# Altium schematic sheet MCU.SchDoc
size Letter
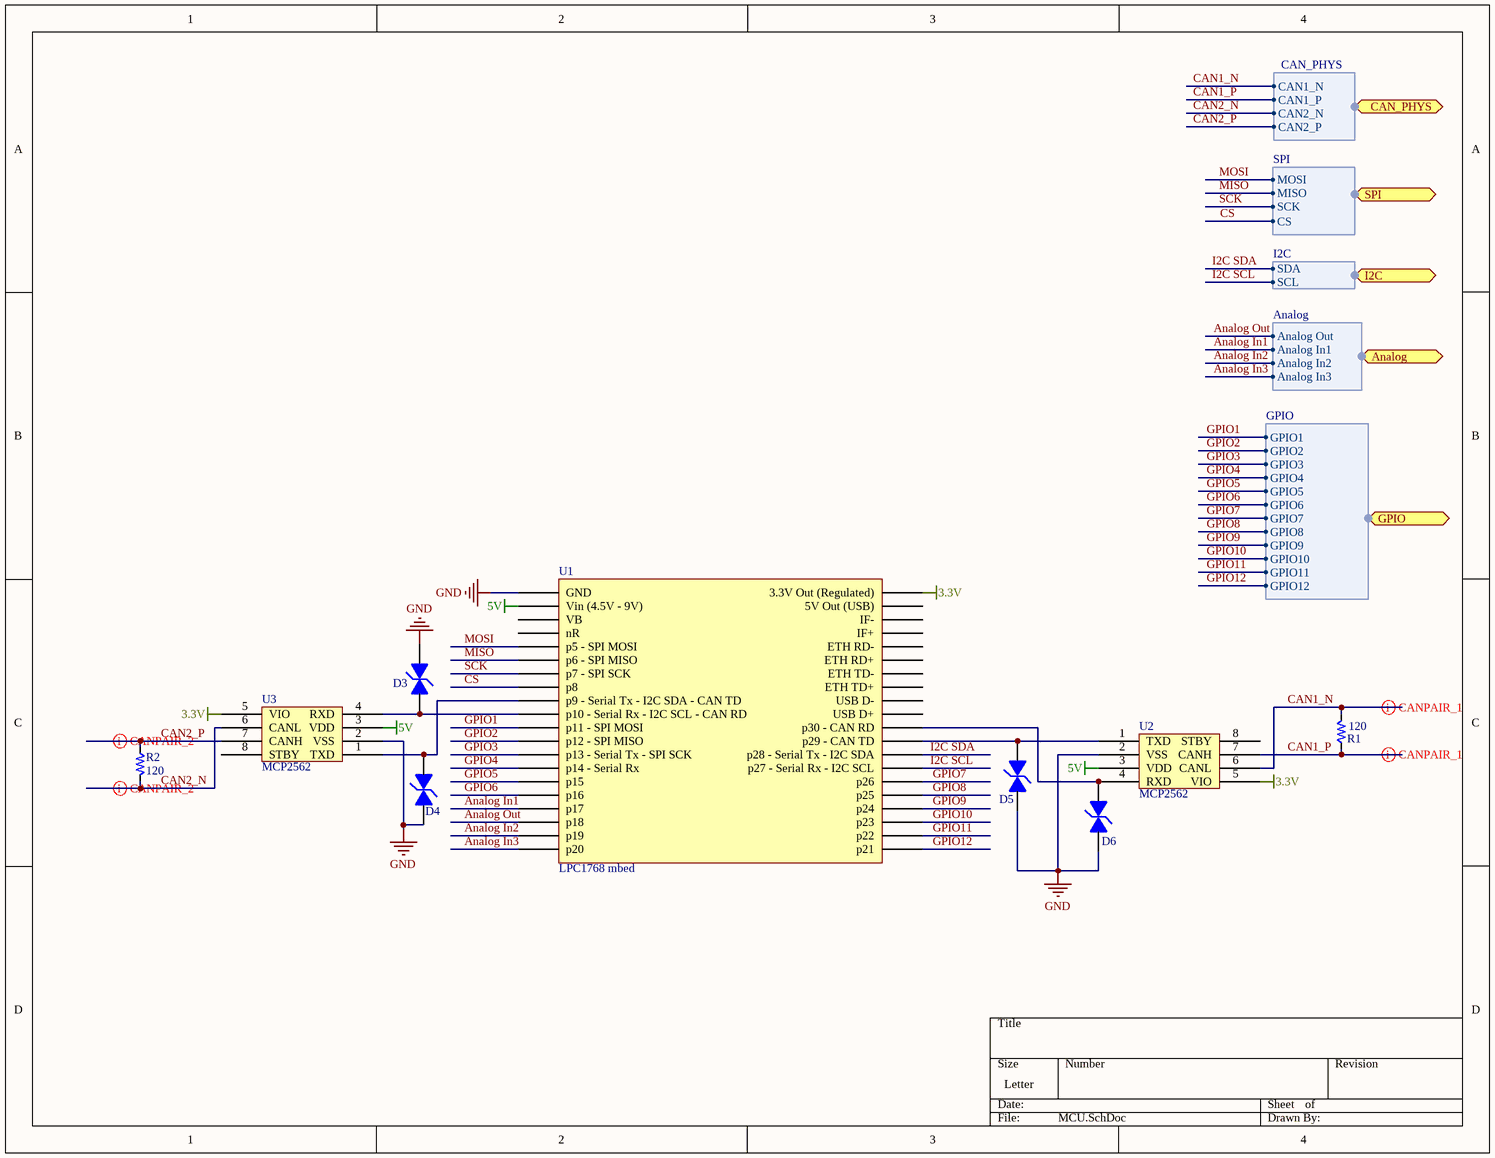
[diagram p0: MCU.SchDoc]

## Parts
D3  TVS Diode  [TVS Diode]  (value not drawn)
D4  TVS Diode  [TVS Diode]  (value not drawn)
D5  TVS Diode  [TVS Diode]  (value not drawn)
D6  TVS Diode  [TVS Diode]  (value not drawn)
R1  120  [PCB_GENERIC_SMD_0603]
R2  120  [PCB_GENERIC_SMD_0603]
U1  LPC1768 mbed  [LPC 1768 mbed Layout]
U2  MCP2562  [MCP2562]
U3  MCP2562  [MCP2562]

## Ports
Analog (harness Analog), CAN_PHYS (harness CAN_PHYS), GPIO (harness GPIO), I2C (harness I2C), SPI (harness SPI)

## Harnesses
CAN_PHYS: CAN1_N, CAN1_P, CAN2_N, CAN2_P
SPI: MOSI, MISO, SCK, CS
I2C: SDA, SCL
GPIO: GPIO1, GPIO2, GPIO3, GPIO4, GPIO5, GPIO6, GPIO7, GPIO8, GPIO9, GPIO10, GPIO11, GPIO12
Analog: Analog Out, Analog In1, Analog In2, Analog In3

## Nets
3.3V: U1.40(3.3V_Out_(Regulated)) U2.5(VIO) U3.5(VIO)
5V: U1.2(Vin_(4.5V_-_9V)) U2.3(VDD) U3.3(VDD)
GND: D3.2 D4.2 D5.1 D6.1 U1.1(GND) U2.2(VSS) U3.2(VSS)
Analog In1: U1.17(p17) ; port Analog.Analog In1
Analog In2: U1.19(p19) ; port Analog.Analog In2
Analog In3: U1.20(p20) ; port Analog.Analog In3
Analog Out: U1.18(p18) ; port Analog.Analog Out
CAN1_N: R1.2 U2.6(CANL) ; port CAN_PHYS.CAN1_N
CAN1_P: R1.1 U2.7(CANH) ; port CAN_PHYS.CAN1_P
CAN2_N: R2.2 U3.6(CANL) ; port CAN_PHYS.CAN2_N
CAN2_P: R2.1 U3.7(CANH) ; port CAN_PHYS.CAN2_P
CS: U1.8(p8) ; port SPI.CS
GPIO1: U1.11(p11_-_SPI_MOSI) ; port GPIO.GPIO1
GPIO2: U1.12(p12_-_SPI_MISO) ; port GPIO.GPIO2
GPIO3: U1.13(p13_-_Serial_Tx_-_SPI_SCK) ; port GPIO.GPIO3
GPIO4: U1.14(p14_-_Serial_Rx) ; port GPIO.GPIO4
GPIO5: U1.15(p15) ; port GPIO.GPIO5
GPIO6: U1.16(p16) ; port GPIO.GPIO6
GPIO7: U1.26(p26) ; port GPIO.GPIO7
GPIO8: U1.25(p25) ; port GPIO.GPIO8
GPIO9: U1.24(p24) ; port GPIO.GPIO9
GPIO10: U1.23(p23) ; port GPIO.GPIO10
GPIO11: U1.22(p22) ; port GPIO.GPIO11
GPIO12: U1.21(p21) ; port GPIO.GPIO12
I2C SCL: U1.27(p27_-_Serial_Rx_-_I2C_SCL) ; port I2C.SCL
I2C SDA: U1.28(p28_-_Serial_Tx_-_I2C_SDA) ; port I2C.SDA
MISO: U1.6(p6_-_SPI_MISO) ; port SPI.MISO
MOSI: U1.5(p5_-_SPI_MOSI) ; port SPI.MOSI
SCK: U1.7(p7_-_SPI_SCK) ; port SPI.SCK
NetD3_1: D3.1 U1.10(p10_-_Serial_Rx_-_I2C_SCL_-_CAN_RD) U3.4(RXD)
NetD4_1: D4.1 U1.9(p9_-_Serial_Tx_-_I2C_SDA_-_CAN_TD) U3.1(TXD)
NetD5_2: D5.2 U1.29(p29_-_CAN_TD) U2.1(TXD)
NetD6_2: D6.2 U1.30(p30_-_CAN_RD) U2.4(RXD)

Not connected (* = marked no-connect by the designer): U1 3(VB) 4(nR) 31(USB_D+) 32(USB_D-) 33(ETH_TD+) 34(ETH_TD-) 35(ETH_RD+) 36(ETH_RD-) 37(IF+) 38(IF-) 39(5V_Out_(USB)); U2 8(STBY); U3 8(STBY)

## Layout directives
differential pair: CAN1_N, CAN1_P, CAN2_N, CAN2_P

## Library data of the parts
D3-D6 = TVS Diode: Manufacturer: Bourns; Manufacturer ID: CDSOD323-T03SC
R1 R2 = SCH_GENERIC_RESISTOR_0603: 120 Ohms; Resistance: 120